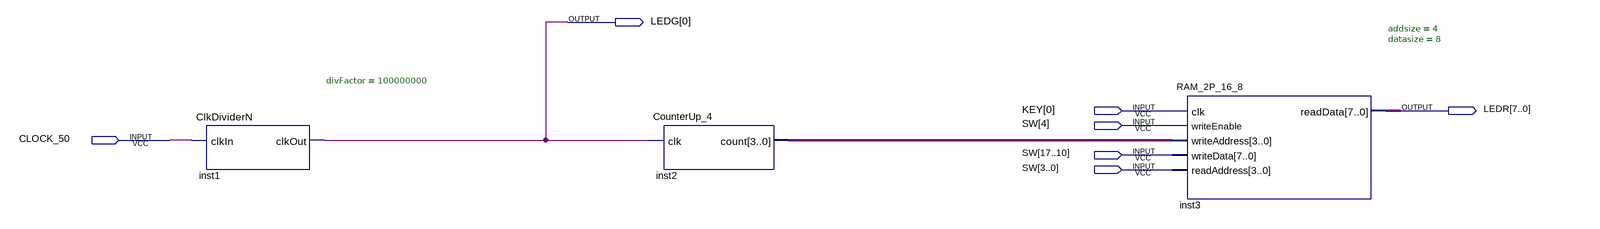
[diagram p0: schematic sheet]
// Quartus schematic RAM_2P_Demo.bdf as structural Verilog: 3 symbols, 7 pins
module RAM_2P_Demo (
  input  [0:0] KEY,
  input  [17:0] SW,
  input  CLOCK_50,
  output [0:0] LEDG,
  output [7:0] LEDR
);

  wire [3:0] inst2_count;

  ClkDividerN #(.divFactor(100000000)) inst1 (.clkIn(CLOCK_50), .clkOut(LEDG[0]));
  CounterUp_4 inst2 (.clk(LEDG[0]), .count(inst2_count));
  RAM_2P_16_8 #(.addsize(4), .datasize(8)) inst3 (
    .clk(KEY[0]), .writeEnable(SW[4]), .writeAddress(inst2_count), .writeData(SW[17:10]),
    .readAddress(SW[3:0]), .readData(LEDR));
endmodule
